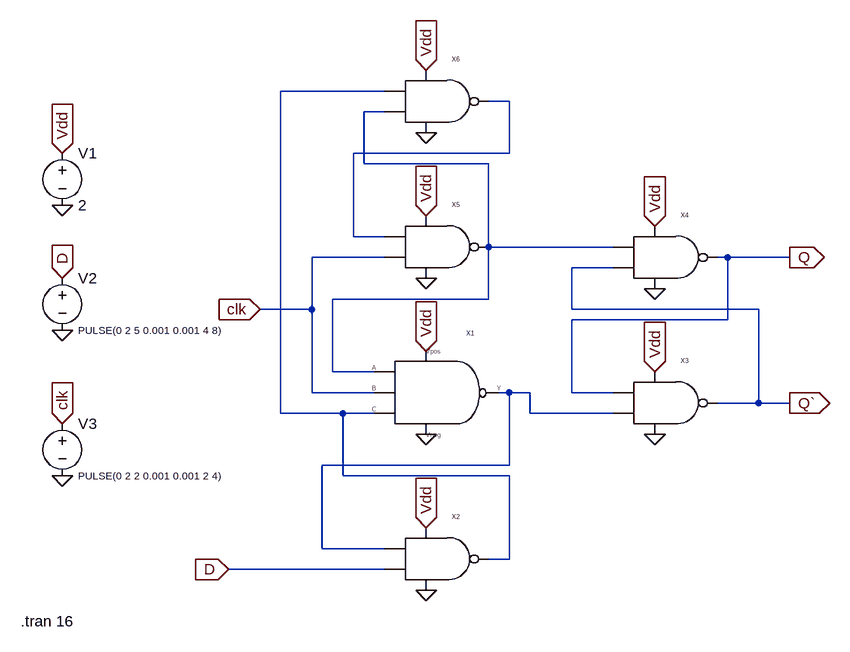
[diagram p0: schematic Edge triggered D flipflop.asc]
Edge triggered D flipflop.asc, the LTspice schematic file:
Version 4
SHEET 1 880 680
WIRE 144 -320 -16 -320
WIRE 336 -304 304 -304
WIRE 144 -288 112 -288
WIRE 336 -224 336 -304
WIRE 336 -224 96 -224
WIRE 112 -208 112 -288
WIRE 304 -208 112 -208
WIRE 96 -96 96 -224
WIRE 144 -96 96 -96
WIRE 304 -80 304 -208
WIRE 496 -80 304 -80
WIRE 144 -64 32 -64
WIRE 672 -64 656 -64
WIRE 768 -64 672 -64
WIRE 496 -48 432 -48
WIRE 304 0 304 -80
WIRE 304 0 64 0
WIRE 32 16 32 -64
WIRE 32 16 -48 16
WIRE 432 16 432 -48
WIRE 720 16 432 16
WIRE 672 32 672 -64
WIRE 672 32 432 32
WIRE 64 112 64 0
WIRE 128 112 64 112
WIRE 32 144 32 16
WIRE 128 144 32 144
WIRE 336 144 320 144
WIRE 368 144 336 144
WIRE 432 144 432 32
WIRE 496 144 432 144
WIRE 720 160 720 16
WIRE 720 160 656 160
WIRE 768 160 720 160
WIRE -16 176 -16 -320
WIRE 80 176 -16 176
WIRE 128 176 80 176
WIRE 368 176 368 144
WIRE 496 176 368 176
WIRE 336 256 336 144
WIRE 336 256 48 256
WIRE 80 272 80 176
WIRE 336 272 80 272
WIRE 48 384 48 256
WIRE 144 384 48 384
WIRE 336 400 336 272
WIRE 336 400 304 400
WIRE 144 416 -96 416
FLAG -352 -224 Vdd
IOPIN -352 -224 In
FLAG 208 -352 Vdd
IOPIN 208 -352 In
FLAG 208 -128 Vdd
IOPIN 208 -128 In
FLAG 560 -112 Vdd
IOPIN 560 -112 In
FLAG 560 112 Vdd
IOPIN 560 112 In
FLAG 208 80 Vdd
IOPIN 208 80 In
FLAG 208 352 Vdd
IOPIN 208 352 In
FLAG -352 -32 D
IOPIN -352 -32 In
FLAG -96 416 D
IOPIN -96 416 In
FLAG -48 16 clk
IOPIN -48 16 In
FLAG -352 192 clk
IOPIN -352 192 In
FLAG 208 -256 0
FLAG 208 -32 0
FLAG 208 208 0
FLAG 208 448 0
FLAG 560 208 0
FLAG 560 -16 0
FLAG -352 -144 0
FLAG -352 48 0
FLAG -352 272 0
FLAG 768 -64 Q
IOPIN 768 -64 Out
FLAG 768 160 Q`
IOPIN 768 160 Out
SYMBOL nand3 208 128 R0
SYMATTR InstName X1
SYMBOL voltage -352 -240 R0
WINDOW 123 0 0 Left 0
WINDOW 39 0 0 Left 0
SYMATTR InstName V1
SYMATTR Value 2
SYMBOL voltage -352 -48 R0
WINDOW 3 24 96 Left 1
WINDOW 123 0 0 Left 0
WINDOW 39 0 0 Left 0
SYMATTR InstName V2
SYMATTR Value PULSE(0 2 5 0.001 0.001 4 8)
SYMBOL voltage -352 176 R0
WINDOW 3 24 96 Left 1
WINDOW 123 0 0 Left 0
WINDOW 39 0 0 Left 0
SYMATTR InstName V3
SYMATTR Value PULSE(0 2 2 0.001 0.001 2 4)
SYMBOL nand 208 400 R0
SYMATTR InstName X2
SYMBOL nand 560 160 R0
SYMATTR InstName X3
SYMBOL nand 560 -64 R0
SYMATTR InstName X4
SYMBOL nand 208 -80 R0
SYMATTR InstName X5
SYMBOL nand 208 -304 R0
SYMATTR InstName X6
TEXT -416 496 Left 2 !.tran 16

The netlist it stands for:
* Edge triggered D flipflop.asc
XX1 N004 N003 clk N001 Vdd 0 nand3  ; pins Y A B C vdd gnd
V1 Vdd 0 2
V2 D 0 PULSE(0 2 5 0.001 0.001 4 8)
V3 clk 0 PULSE(0 2 2 0.001 0.001 2 4)
XX2 N004 D Vdd 0 N001 nand  ; pins A B vdd gnd Y
XX3 Q N004 Vdd 0 Q` nand  ; pins A B vdd gnd Y
XX4 N003 Q` Vdd 0 Q nand  ; pins A B vdd gnd Y
XX5 N002 clk Vdd 0 N003 nand  ; pins A B vdd gnd Y
XX6 N001 N003 Vdd 0 N002 nand  ; pins A B vdd gnd Y
.tran 16
.backanno
.end

* Results of the author's LTspice run, read from the files saved beside the schematic
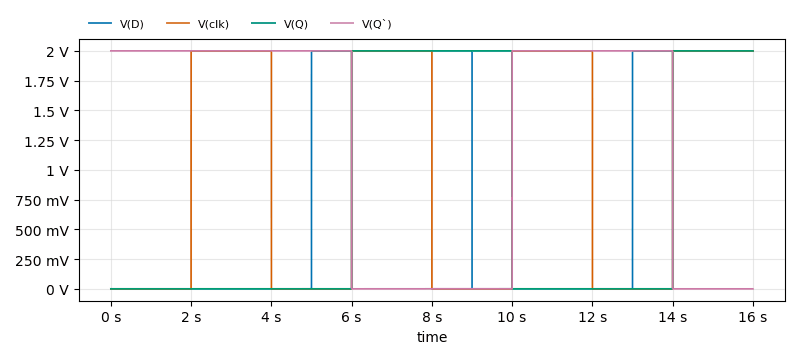
[diagram p1: Transient Analysis of Edge triggered D flipflop.asc, plotted from the saved traces]
* Transient Analysis, 1 run:
*   V(D): min 0 V, max 2 V, average 875.1 mV, rms 1.323 V, last 2 V
*   V(clk): min 0 V, max 2 V, average 1 V, rms 1.414 V, last 2 V
*   V(Q): min 401 nV, max 2 V, average 749.9 mV, rms 1.225 V, last 2 V
*   V(Q`): min 328.9 nV, max 2 V, average 1.25 V, rms 1.581 V, last 401 nV